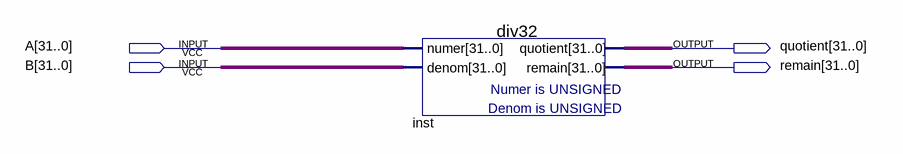
[diagram p0: schematic sheet]
// Quartus schematic div+mod.bdf as structural Verilog: 1 symbols, 4 pins
module \div+mod  (
  input  [31:0] A,
  input  [31:0] B,
  output [31:0] quotient,
  output [31:0] remain
);

  div32 inst (.numer(A), .denom(B), .quotient(quotient), .remain(remain));
endmodule
